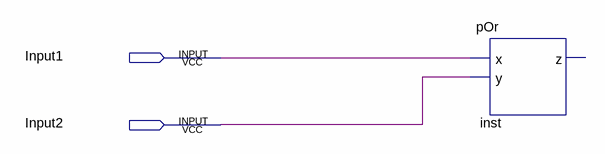
[diagram p0: schematic sheet]
// Quartus schematic block_pOr.bdf as structural Verilog: 1 symbols, 2 pins
module block_pOr (
  input  Input1,
  input  Input2
);

  pOr inst (.x(Input1), .y(Input2));  // open: z
endmodule
